# EAGLE design INTERRUPTOR (EAGLE 9.6.2)
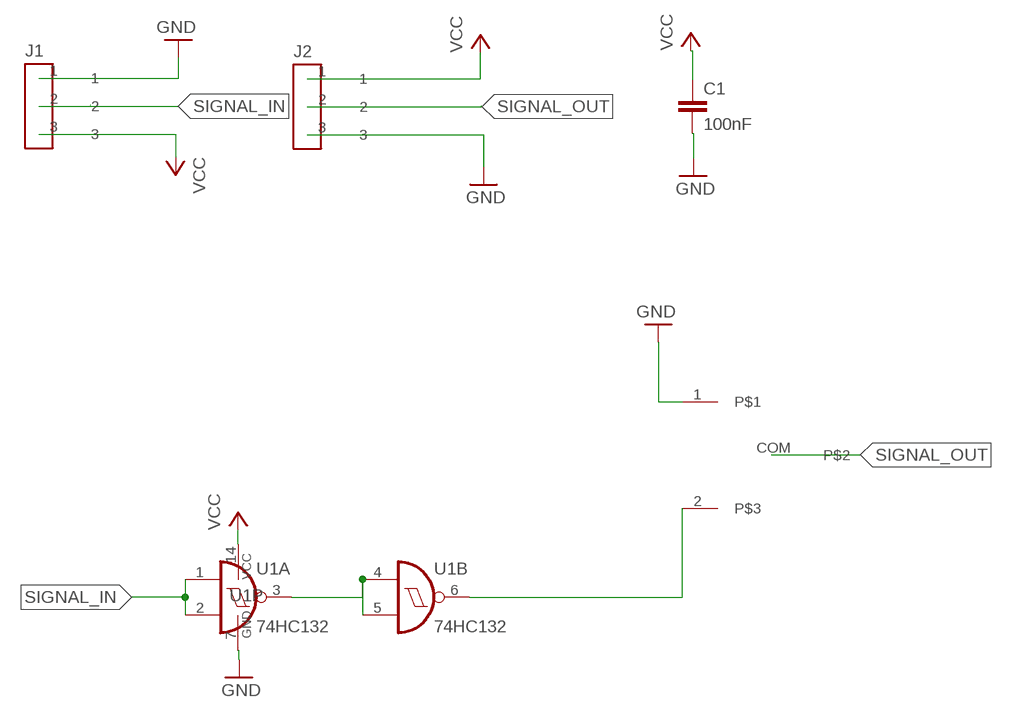
[diagram p0: schematic, sheet 1]

## Parts
C1  100nF  C-EUC0805  [C0805]
J1  CONECTOR_MACHO  [MALE]
J2  CONECTOR_FEMEA  [FEMALE]
J3  SS12F46  [SS12F46]
U1  74HC132  74HC132D  [SO14]

## Nets
GND: C1.2 J1.1 J2.3 J3.1 U1.7(P:GND)
N$2: U1.3(A:O) U1.4(B:I0) U1.5(B:I1)
N$3: J3.2 U1.6(B:O)
SIGNAL_IN: J1.2 U1.1(A:I0) U1.2(A:I1)
SIGNAL_OUT: J2.2 J3.COM
VCC: C1.1 J1.3 J2.1 U1.14(P:VCC)
Unconnected: U1.8(C:O) U1.9(C:I0) U1.10(C:I1) U1.11(D:O) U1.12(D:I0) U1.13(D:I1)

## Library data of the parts
C1 = rcl:C-EU: CAPACITOR, European symbol; SPICEPREFIX: C
J1 = Eletroblocks Lib:CONECTOR_MACHO
J2 = Eletroblocks Lib:CONECTOR_FEMEA
J3 = Eletroblocks Lib:SS12F46
U1 = 74xx-eu:74*132: Quad 2-input NAND schmitt trigger

## Board
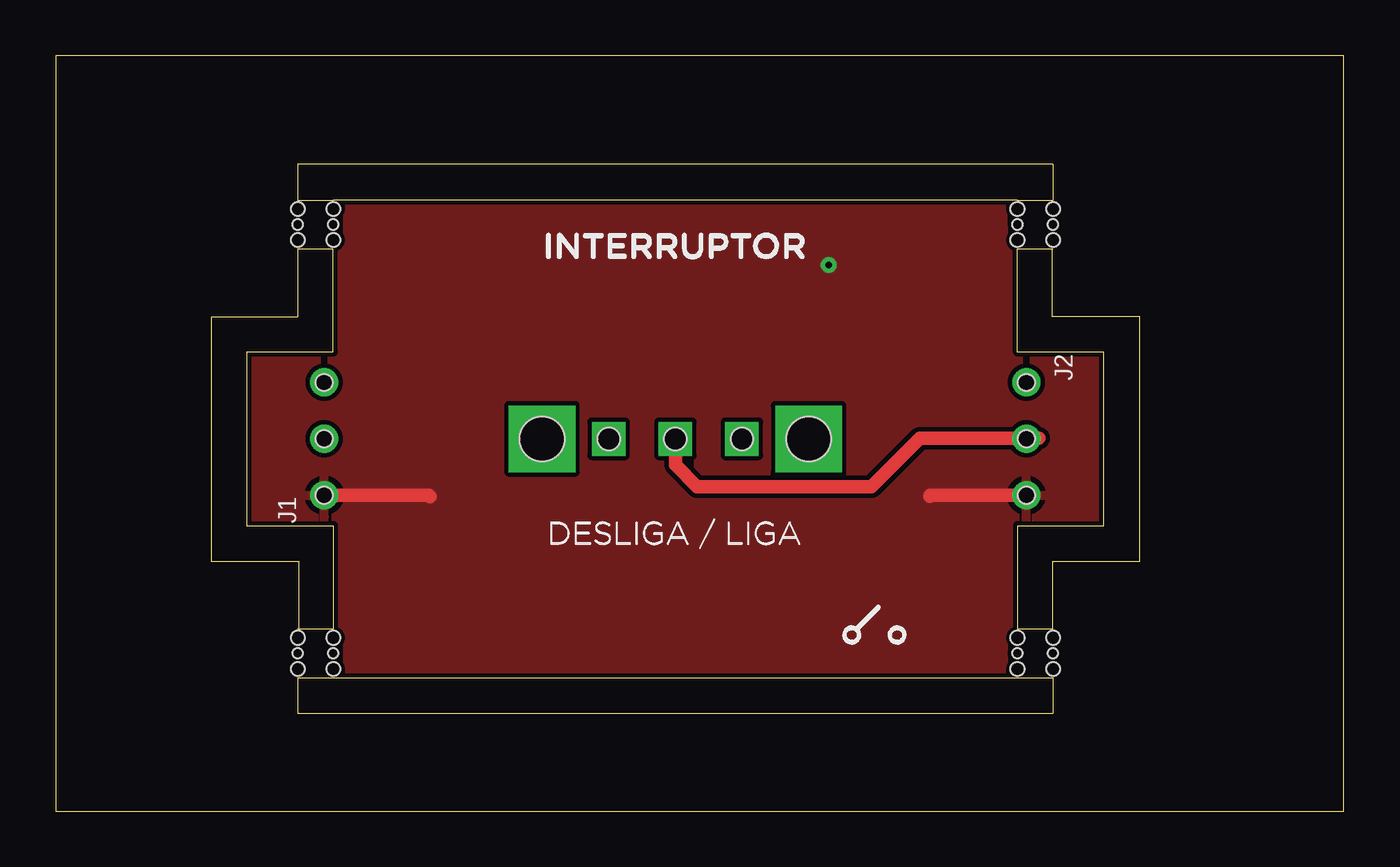
[diagram p1: board, top side]
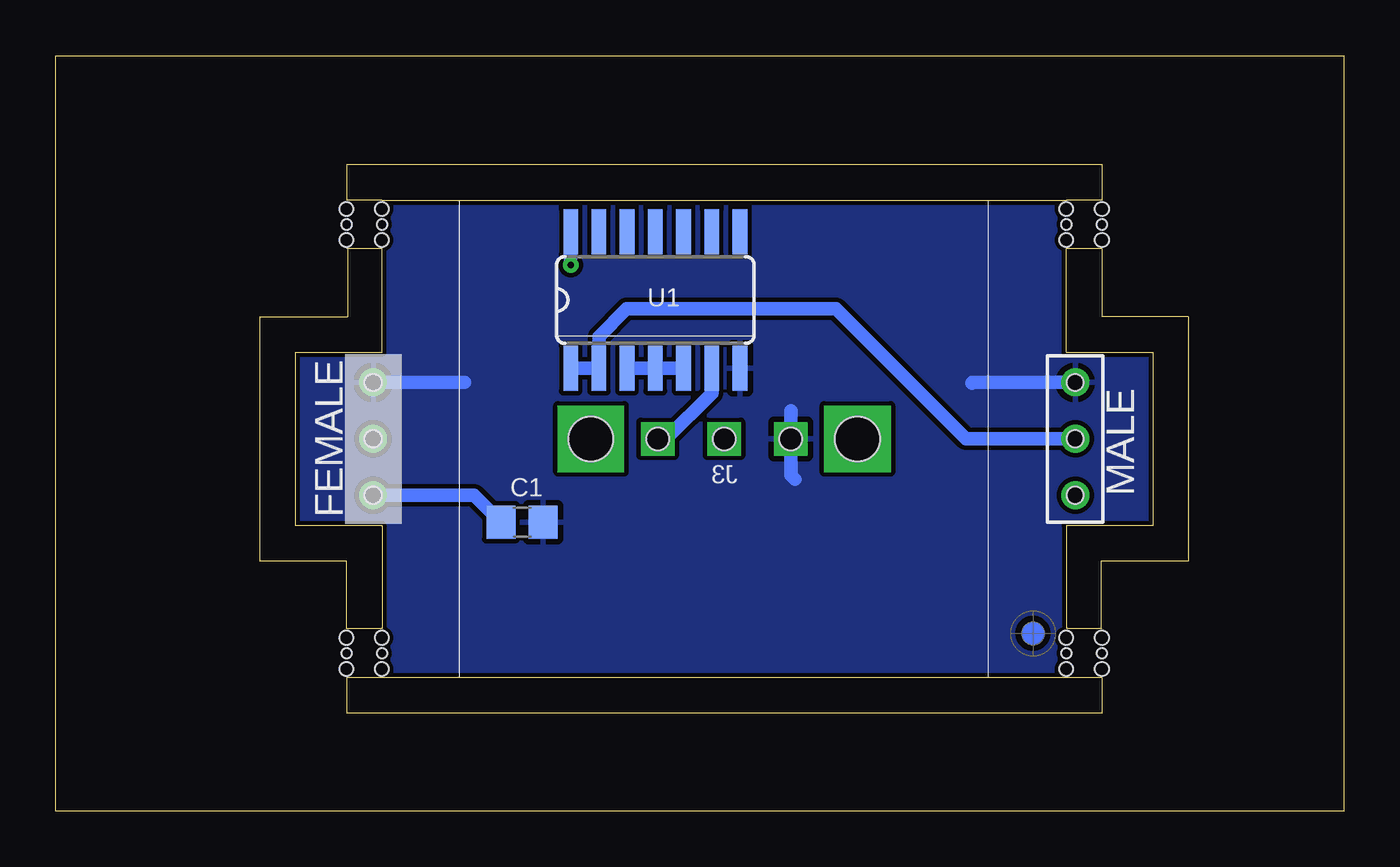
[diagram p2: board, bottom side, seen from below]

Size 58 x 34 mm. Coordinates in mm from the lower left corner, seen from the top.
Outline: 12.5,6 43.3,6
Outline: 43.3,27.5 12.5,27.5
Outline: 10.9,6 10.9,4.4 44.9,4.4 44.9,6
Outline: 44.9,8.2 44.9,11.25 48.8,11.25 48.8,22.25 44.85,22.25 44.85,25.3 43.3,25.3 43.3,20.65 47.2,20.65 47.2,12.85 43.3,12.85 43.3,8.2
Outline: 44.9,27.5 44.9,29.1 10.9,29.1 10.9,27.5
Outline: 10.9,25.3 10.9,22.25 7,22.25 7,11.25 10.95,11.25 10.95,8.2 12.5,8.2 12.5,12.85 8.6,12.85 8.6,20.65 12.5,20.65 12.5,25.3
Outline: 0,34 0,0 58,0 58,34 0,34
Copper layers (1*16): Top 0.035mm / dielectric 1.5mm / Bottom 0.035mm
Design rules "default *": minimum track width 6mil, minimum drill 0.35mm, track to track 8mil, track to pad 8mil, pad to pad 8mil, via to via 8mil, smd to smd 8mil, copper to edge 8mil, drill to drill 8mil, minimum pad ring 10mil, minimum via ring 8mil, stop-mask expansion 4mil, vias tented up to drill 1mm, thermal gap 10mil

### Footprints (pad centres in the part's own frame; a part is rotated, then mirrored left to right if it is on the bottom)
C0805 = smd 1.3 x 1.5: 1 -0.95,0; 2 0.95,0
MALE = drill 0.75: 1 0,2.54; 2 0,0; 3 0,-2.54 | hole 0.75: 0,2.54; 0,0; 0,-2.54
FEMALE = drill 0.75: 1 0,2.54; 2 0,0; 3 0,-2.54 | hole 0.75: 0,2.54; 0,0; 0,-2.54
SS12F46 = drill 1 square: 1 -3,0; 2 3,0; COM 0,0 | drill 2 square: CON1 -6,0; CON2 6,0 | hole 1: 0,-0.01; -3,0; 3,0 | hole 2: -6,0; 6,0
SO14 = smd 0.66 x 2.032: 1 -3.81,-3.073; 2 -2.54,-3.073; 3 -1.27,-3.073; 4 0,-3.073; 5 1.27,-3.073; 6 2.54,-3.073; 7 3.81,-3.073; 8 3.81,3.073; 9 2.54,3.073; 10 1.27,3.073; 11 0,3.073; 12 -1.27,3.073; 13 -2.54,3.073; 14 -3.81,3.073
STAMP_DUPLO = hole 0.45: 0,0; 0,-1.6 | hole 0.6: 0.7,0; -0.7,0; 0.7,-1.6; -0.7,-1.6

### Placement (x,y rotation side)
C1  37,13 0 bottom
J1  12.1,16.75 0 top
J2  43.7,16.75 180 top
J3  27.9,16.75 0 top
U1  31,23 0 bottom
U$1  [STAMP_DUPLO]  10.9,7.1 90 top
U$2  [FIDUCIAL_G10]  14,8 0 bottom
U$3  [STAMP_DUPLO]  10.9,26.4 90 top
U$4  [STAMP_DUPLO]  43.3,7.1 90 top
U$5  [STAMP_DUPLO]  43.3,26.4 90 top

### Tracks (layer width: path | path; a pad name or v marks a point on that pad's centre or on a via)
GND
  Bottom 0.61: J1.1 16.72,19.29 16.75,19.26 | J2.3 39.59,19.29 39.58,19.3 | 24.89,18.02 24.9,18.01 J3.1 24.9,15.11 24.71,14.93
  pour Bottom: 7.93,6 47.8,6 47.8,27.5 7.93,27.5
N$2
  Bottom 0.61: U1.3 U1.4 U1.5
N$3
  Bottom 0.61: U1.6 28.46,18.8 30.51,16.75 J3.2
SIGNAL_IN
  Bottom 0.61: J1.2 17.02,16.75 17.01,16.76 22.86,22.61 32.29,22.61 33.54,21.35 U1.2 U1.1
SIGNAL_OUT
  Top 0.61: J2.2 44.27,16.77 38.9,16.77 36.73,14.61 28.87,14.61 27.9,15.58 J3.COM
VCC  (via drill 0.3)
  Top 0.61: J1.3 16.79,14.21 16.85,14.14 | J2.1 39.39,14.21 39.36,14.18
  Bottom 0.61: U1.14 v34.81,24.58 | J2.1 39.16,14.21 C1.1
  pour Top: 7.93,6 7.93,27.34 47.93,27.34 47.93,6

### Text on the board
tStop: V1.0.2
bStop: V1.0.2